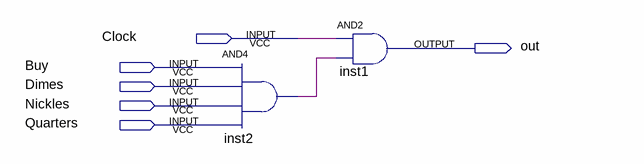
[diagram p0: schematic sheet]
// Quartus schematic vendingadder.bdf as structural Verilog: 2 symbols, 6 pins
module vendingadder (
  input  Clock,
  input  Buy,
  input  Dimes,
  input  Nickles,
  input  Quarters,
  output out
);

  wire inst2_out;

  and inst2 (inst2_out, Buy, Dimes, Nickles, Quarters);
  and inst1 (out, Clock, inst2_out);
endmodule
